# EasyEDA schematic SCH_ESP-CellCore_USB_Interlock_RevA3_2.json
TITLE: Sheet_1; REV: 1.0; Date: 2026-08-07; Sheet: 1/1; Drawn By: evilroot; Company: Your Company
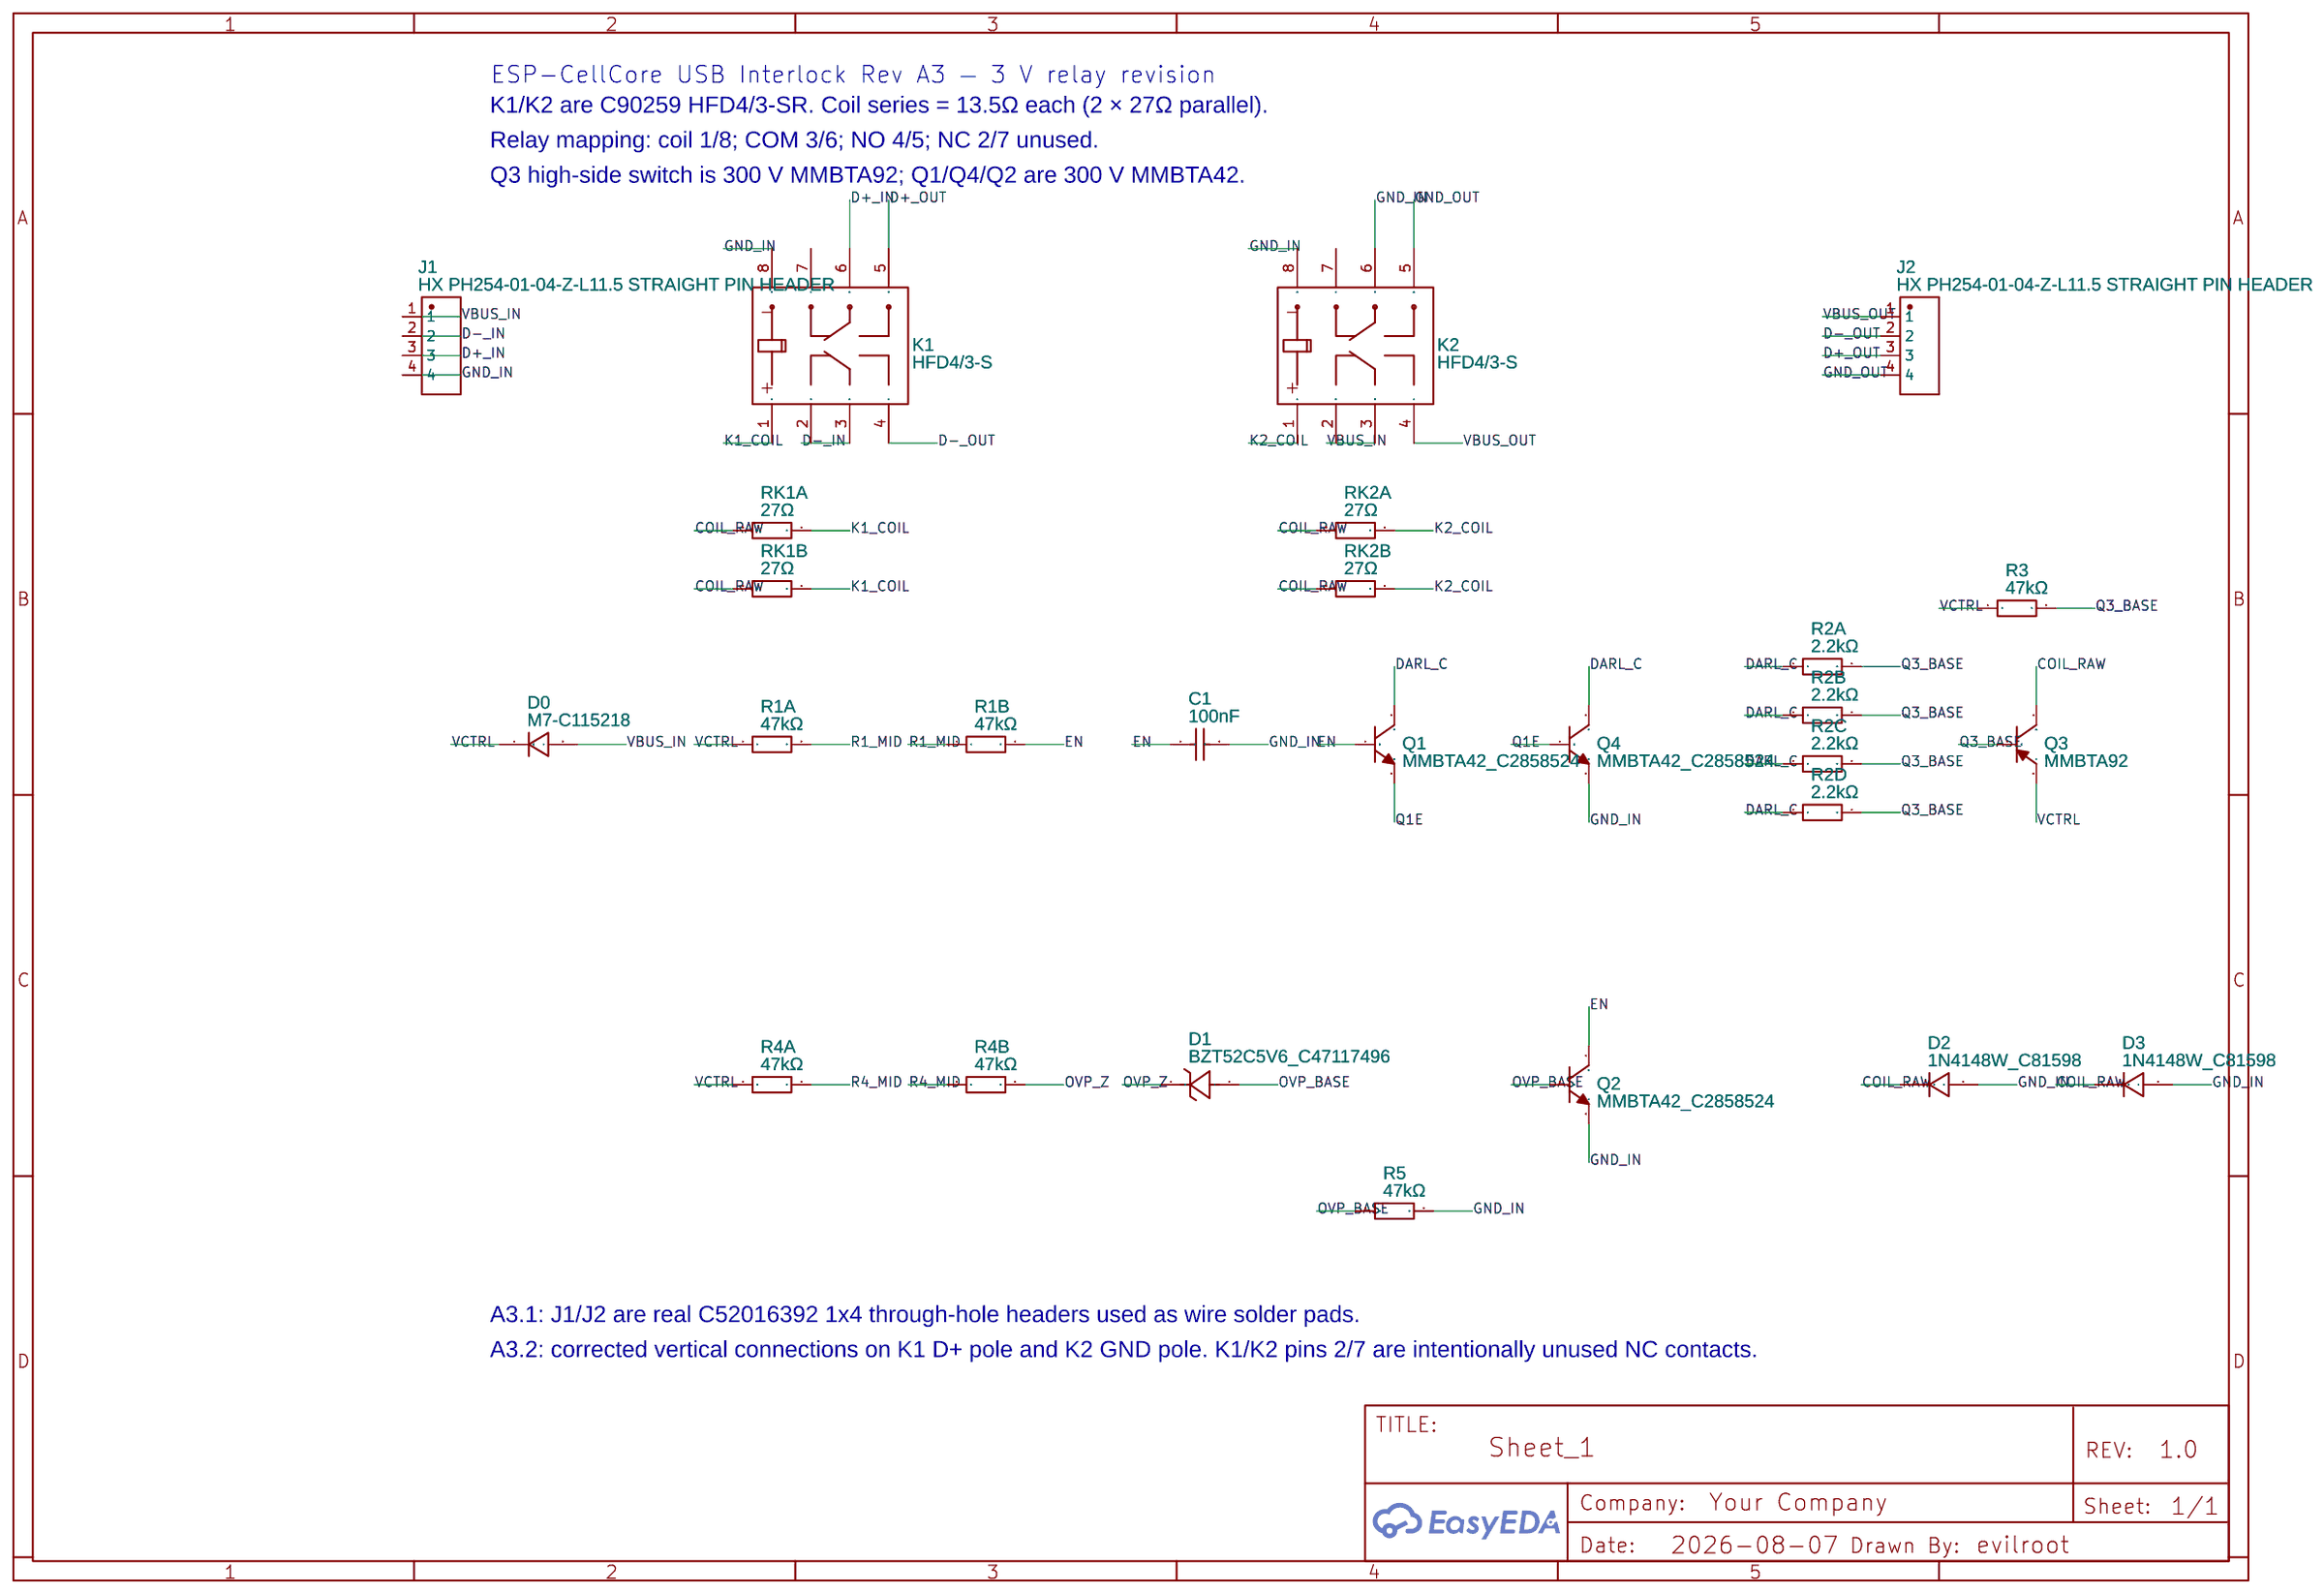
[diagram p0: schematic sheet]

## Parts
C1  100nF  [C0805]
D0  M7-C115218  [SMA_L4.4-W2.6-LS5.0-RD]
D1  BZT52C5V6_C47117496  [SOD-123_L2.7-W1.6-LS3.7-RD]
D2  1N4148W_C81598  [SOD-123F_L2.7-W1.6-LS3.8-RD]
D3  1N4148W_C81598  [SOD-123F_L2.7-W1.6-LS3.8-RD]
J1  HX PH254-01-04-Z-L11.5 STRAIGHT PIN HEADER  [HDR-TH_4P-HX-PH254-01-04-Z-L11.5]
J2  HX PH254-01-04-Z-L11.5 STRAIGHT PIN HEADER  [HDR-TH_4P-HX-PH254-01-04-Z-L11.5]
K1  HFD4/3-S  [RELAY-SMD_HFD4-XX-SR]
K2  HFD4/3-S  [RELAY-SMD_HFD4-XX-SR]
Q1  MMBTA42_C2858524  [SOT-23-3_L2.9-W1.5-P1.90-LS2.6-BR]
Q2  MMBTA42_C2858524  [SOT-23-3_L2.9-W1.5-P1.90-LS2.6-BR]
Q3  MMBTA92  [SOT-23-3_L2.9-W1.3-P1.90-LS2.4-BR]
Q4  MMBTA42_C2858524  [SOT-23-3_L2.9-W1.5-P1.90-LS2.6-BR]
R1A  47kΩ  [R0805]
R1B  47kΩ  [R0805]
R2A  2.2kΩ  [R0805]
R2B  2.2kΩ  [R0805]
R2C  2.2kΩ  [R0805]
R2D  2.2kΩ  [R0805]
R3  47kΩ  [R0805]
R4A  47kΩ  [R0805]
R4B  47kΩ  [R0805]
R5  47kΩ  [R0805]
RK1A  27Ω  [R0805]
RK1B  27Ω  [R0805]
RK2A  27Ω  [R0805]
RK2B  27Ω  [R0805]

## Library data of the parts
C1 = C0805C104K5RACTU: Contributor: LCSC; Supplier: LCSC; Manufacturer: KEMET(基美); Manufacturer Part: C0805C104K5RAC7800; Supplier Part: C75414; JLCPCB Part Class: Extended Part
D0 = M7-C115218: Contributor: LCSC; Supplier: LCSC; Supplier Part: C115218; Manufacturer: 晶导微电子; Manufacturer Part: M7; JLCPCB Part Class: Extended Part
D1 = BZT52C5V6_C47117496: Supplier: LCSC; Supplier Part: C47117496; Manufacturer: baocheng(宝乘); Manufacturer Part: BZT52C5V6; JLCPCB Part Class: Extended Part; Contributor: lcsc
D2 D3 = 1N4148W_C81598: Supplier: LCSC; Manufacturer: ST(先科); Manufacturer Part: 1N4148W; Supplier Part: C81598; JLCPCB Part Class: Basic Part
J1 J2 = HX PH254-01-04-Z-L11.5 STRAIGHT PIN HEADER: Supplier: LCSC; Supplier Part: C52016392; Manufacturer: hanxia(韩下); Manufacturer Part: HX PH254-01-04-Z-L11.5 straight pin header; JLCPCB Part Class: Extended Part; Contributor: lcsc
K1 K2 = HFD4/3-S: Contributor: LCSC; Supplier: LCSC; Supplier Part: C90259; Manufacturer: HF(宏发); Manufacturer Part: HFD4/3-SR; JLCPCB Part Class: Extended Part
Q1 Q2 Q4 = MMBTA42_C2858524: Contributor: LCSC; Supplier: LCSC; Supplier Part: C2858524; Manufacturer: MDD(辰达半导体); Manufacturer Part: MMBTA42; JLCPCB Part Class: Extended Part
Q3 = MMBTA92: Contributor: LCSC; Supplier: LCSC; Supplier Part: C909761; Manufacturer: GOODWORK(固得沃克); JLCPCB Part Class: Extended Part
R1A R1B R3 R4A R4B R5 = AC0805FR-0747KL: Contributor: LCSC; Supplier: LCSC; Manufacturer: YAGEO(国巨); Supplier Part: C144558; JLCPCB Part Class: Extended Part
R2A R2B R2C R2D = 0805W8F2201T5E: Supplier: LCSC; Manufacturer: UNI-ROYAL(厚声); Supplier Part: C17520; JLCPCB Part Class: Basic Part
RK1A RK1B RK2A RK2B = CR0805F827R0G: Supplier: LCSC; Manufacturer: LIZ(丽智电子); Supplier Part: C101623; JLCPCB Part Class: Extended Part

## Nets
GND_IN: C1.2 D2.2(A) D3.2(A) J1.4 K1.8 K2.6 K2.8 Q2.2(E) Q4.2(E) R5.2
GND_OUT: J2.4 K2.5
VBUS_IN: D0.2(A) J1.1 K2.3
VBUS_OUT: J2.1 K2.4
COIL_RAW: D2.1(K) D3.1(K) Q3.3(C) RK1A.1 RK1B.1 RK2A.1 RK2B.1
D+_IN: J1.3 K1.6
D+_OUT: J2.3 K1.5
D-_IN: J1.2 K1.3
D-_OUT: J2.2 K1.4
DARL_C: Q1.3(C) Q4.3(C) R2A.1 R2B.1 R2C.1 R2D.1
EN: C1.1 Q1.1(B) Q2.3(C) R1B.2
K1_COIL: K1.1 RK1A.2 RK1B.2
K2_COIL: K2.1 RK2A.2 RK2B.2
OVP_BASE: D1.2(A) Q2.1(B) R5.1
OVP_Z: D1.1(C) R4B.2
Q1E: Q1.2(E) Q4.1(B)
Q3_BASE: Q3.1(B) R2A.2 R2B.2 R2C.2 R2D.2 R3.2
R1_MID: R1A.2 R1B.1
R4_MID: R4A.2 R4B.1
VCTRL: D0.1(C) Q3.2(E) R1A.1 R3.1 R4A.1

Not connected (* = marked no-connect by the designer): K1 2 7; K2 2 7

## Notes on the sheet
- ESP-CellCore USB Interlock Rev A3 — 3 V relay revision
- K1/K2 are C90259 HFD4/3-SR. Coil series = 13.5Ω each (2 × 27Ω parallel).
- Relay mapping: coil 1/8; COM 3/6; NO 4/5; NC 2/7 unused.
- Q3 high-side switch is 300 V MMBTA92; Q1/Q4/Q2 are 300 V MMBTA42.
- A3.1: J1/J2 are real C52016392 1x4 through-hole headers used as wire solder pads.
- A3.2: corrected vertical connections on K1 D+ pole and K2 GND pole. K1/K2 pins 2/7 are intentionally unused NC contacts.
